# Altium schematic sheet AlertesLocales.SchDoc: Alerte Local
size A4; DrawnBy: Alves Adam; Revision: V0.1 Rev A; SheetNumber: 9; SheetTotal: 9
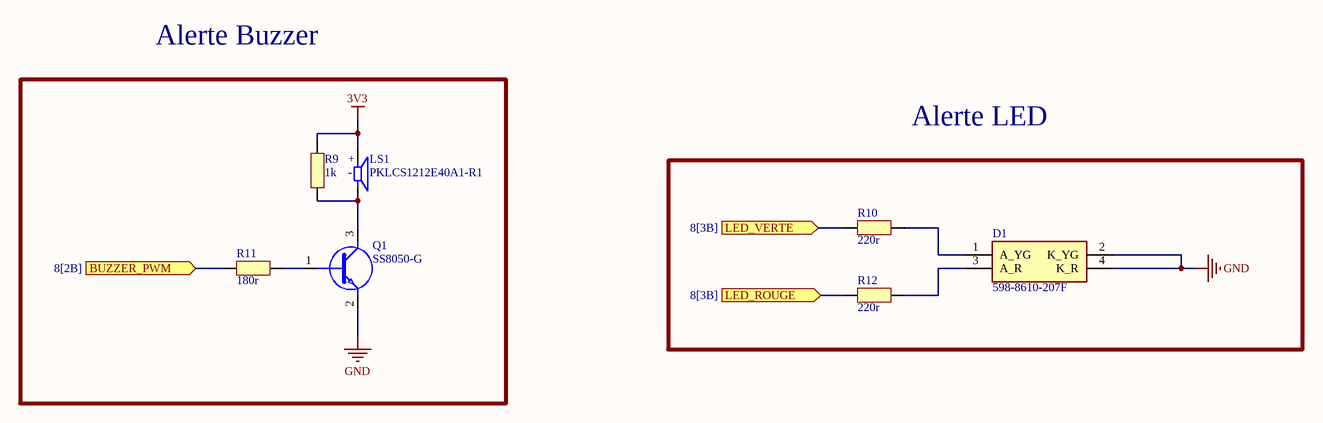
[diagram p0: AlertesLocales.SchDoc]

## Parts
D1  598-8610-207F  [5988610207F]
LS1  PKLCS1212E40A1-R1  [SPKR_PKLCS1212E40A1-R1]
Q1  SS8050-G  [SS8050-G]
R9  1k  [RESC1005X06N]
R10  220r  [RESC1005X06N]
R11  180r  [RESC1005X06N]
R12  220r  [RESC1005X06N]

## Ports
BUZZER_PWM (in, see 8[2B]), LED_ROUGE (in, see 8[3B]), LED_VERTE (in, see 8[3B])

## Nets
3V3: LS1.P R9.2
GND: D1.2(K_YG) D1.4(K_R) Q1.2(E)
BUZZER_PWM: R11.1 ; port BUZZER_PWM
LED_ROUGE: R12.1 ; port LED_ROUGE
LED_VERTE: R10.1 ; port LED_VERTE
NetD1_1: D1.1(A_YG) R10.2
NetD1_3: D1.3(A_R) R12.2
NetLS1_N: LS1.N Q1.3(C) R9.1
NetQ1_1: Q1.1(B) R11.2

## Notes on the sheet
- Alerte Buzzer
- Alerte LED
- (in symbol PKLCS1212E40A1-R1) +; -

## Library data of the parts
D1 = 598-8610-207F: Standard LEDs - SMD Red/Green WC 80/50mcd 645/570nm; Manufacturer_Name: Dialight; Geometry.Height: 0.8mm; Manufacturer_Part_Number: 598-8610-207F; Mouser Part Number: 645-598-8610-207F; Mouser Price/Stock: https://www.mouser.co.uk/ProductDetail/Dialight/598-8610-207F?qs=7JStj%2FjQ2SFuCjosqwklHQ%3D%3D; Arrow Part Number: 598-8610-207F; Arrow Price/Stock: https://www.arrow.com/en/products/598-8610-207f/dialight?region=nac; Datasheet Link: https://media.digikey.com/pdf/Data%20Sheets/Dialight%20PDFs/598%20Series%201210%20Pkg%20Bi-Color.pdf
LS1 = PKLCS1212E40A1-R1: Buzzers Transducer, Externally Driven Piezo 1.5V 2kHz 70dB @ 1.5V, 10cm Surface Mount Solder Pads; MF: Murata Electronics; Value: *; MP: PKLCS1212E40A1-R1; Package: None; Availability: Unavailable; Price: None
Q1 = SS8050-G: Bipolar Transistors - BJT NPN TRANSISTOR 1.5A 40V
R9-R12 = Resistor